# EAGLE design electron-power-bq24298 (EAGLE 7.2.0)
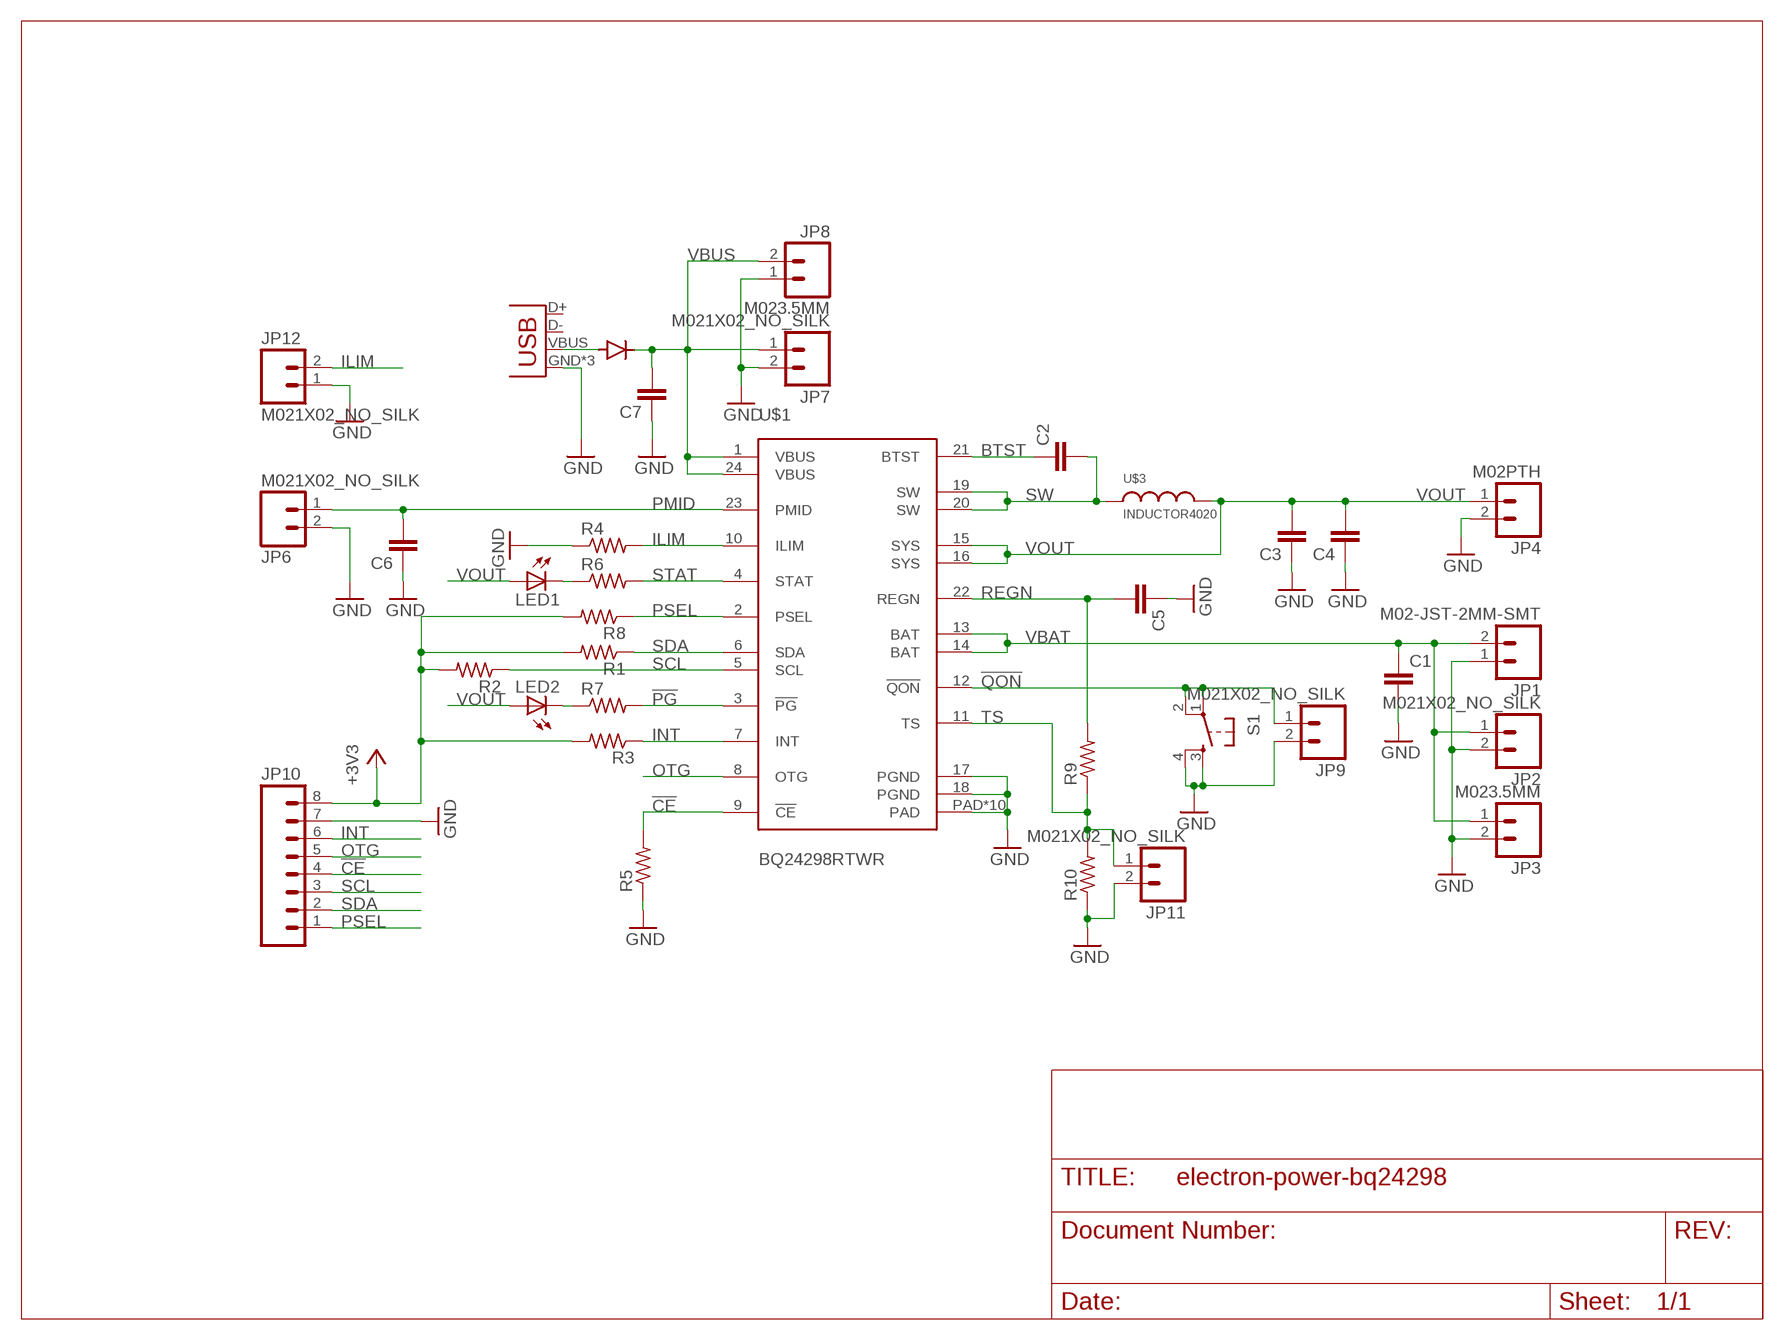
[diagram p0: schematic, sheet 1]

## Parts
C1  C-EUC0805  [C0805]
C2  C-EUC0402  [C0402]
C3  C-EUC0805  [C0805]
C4  C-EUC0805  [C0805]
C5  C-EUC0402  [C0402]
C6  C-EUC0805  [C0805]
C7  C-EUC0805  [C0805]
JP1  M02-JST-2MM-SMT  [JST-2-SMD]
JP2  M021X02_NO_SILK  [1X02_NO_SILK]
JP3  M023.5MM  [SCREWTERMINAL-3.5MM-2]
JP4  M02PTH  [1X02]
JP5  USBUSB-MICROB-SLOT-HOLE  [USB-MICROB-SLOT-HOLE]
JP6  M021X02_NO_SILK  [1X02_NO_SILK]
JP7  M021X02_NO_SILK  [1X02_NO_SILK]
JP8  M023.5MM  [SCREWTERMINAL-3.5MM-2]
JP9  M021X02_NO_SILK  [1X02_NO_SILK]
JP10  M08NO_SILK  [1X08_NO_SILK]
JP11  M021X02_NO_SILK  [1X02_NO_SILK]
JP12  M021X02_NO_SILK  [1X02_NO_SILK]
LED1  LEDSML0805  [SML0805]
LED2  LEDSML0805  [SML0805]
R1  R-US_R0402  [R0402]
R2  R-US_R0402  [R0402]
R3  R-US_R0402  [R0402]
R4  R-US_R0402  [R0402]
R5  R-US_R0402  [R0402]
R6  R-US_R0402  [R0402]
R7  R-US_R0402  [R0402]
R8  R-US_R0402  [R0402]
R9  R-US_R0402  [R0402]
R10  R-US_R0402  [R0402]
S1  TAC_SWITCHSMD  [TACTILE_SWITCH_SMD]
U$1  BQ24298RTWR  [QFN24]
U$2  DIODE  [DIODE-DO-220AA(SMP)]
U$3  INDUCTOR4020  [4020TYPE]

## Nets
!CE: JP10.4 R5.2 U$1.9(!CE)
!PG: R7.2 U$1.3(!PG)
!QON: JP9.1 S1.1 S1.2 U$1.12(!QON)
+3V3: JP10.8 R1.2 R2.2 R3.2 R8.2
BTST: C2.1 U$1.21(BTST)
GND: C1.2 C3.1 C4.1 C5.1 C6.1 C7.1 JP1.1 JP2.2 JP3.2 JP4.2 JP5.GND JP5.MT1(GND) JP5.MT2(GND) JP6.2 JP7.2 JP8.1 JP9.2 JP10.7 JP11.2 JP12.1 R4.1 R5.1 R10.1 S1.3 S1.4 U$1.17(PGND) U$1.18(PGND) U$1.PAD U$1.PAD@1(PAD) U$1.PAD@2(PAD) U$1.PAD@3(PAD) U$1.PAD@4(PAD) U$1.PAD@5(PAD) U$1.PAD@6(PAD) U$1.PAD@7(PAD) U$1.PAD@8(PAD) U$1.PAD@9(PAD)
ILIM: JP12.2 R4.2 U$1.10(ILIM)
INT: JP10.6 R3.1 U$1.7(INT)
N$2: JP5.VBUS U$2.ANODE
N$6: LED1.C R6.1
N$9: LED2.C R7.1
OTG: JP10.5 U$1.8(OTG)
PMID: C6.2 JP6.1 U$1.23(PMID)
PSEL: JP10.1 R8.1 U$1.2(PSEL)
REGN: C5.2 R9.2 U$1.22(REGN)
SCL: JP10.3 R2.1 U$1.5(SCL)
SDA: JP10.2 R1.1 U$1.6(SDA)
STAT: R6.2 U$1.4(STAT)
SW: C2.2 U$1.19(SW) U$1.20(SW) U$3.P$1
TS: JP11.1 R9.1 R10.2 U$1.11(TS)
VBAT: C1.1 JP1.2 JP2.1 JP3.1 U$1.13(BAT) U$1.14(BAT)
VBUS: C7.2 JP7.1 JP8.2 U$1.1(VBUS) U$1.24(VBUS) U$2.CATHODE
VOUT: C3.2 C4.2 JP4.1 LED1.A LED2.A U$1.15(SYS) U$1.16(SYS) U$3.P$2
Unconnected: JP5.D+ JP5.D-

## Library data of the parts
C1-C7 = rcl:C-EU: CAPACITOR, European symbol
JP1 = SparkFun-Connectors:M02: Standard 2-pin 0.1" header. Use with - straight break away headers ( PRT-00116) - right angle break away headers (PRT-00553) - swiss pins (PRT-00743) - machine pins (PRT-00117) - female headers (PRT-00115) Molex polarized connector foot print use with: PRT-08233 with associated crimp pins and housings. 2.54_SCREWTERM for use with PRT-10571. 3.5mm Screw Terminal footprints for PRT-08084 5mm Screw Terminal footprints for use with PRT-08433; PROD_ID: CONN-08352
JP2-JP4 JP6-JP9 JP11 JP12 = SparkFun-Connectors:M02: Standard 2-pin 0.1" header. Use with - straight break away headers ( PRT-00116) - right angle break away headers (PRT-00553) - swiss pins (PRT-00743) - machine pins (PRT-00117) - female headers (PRT-00115) Molex polarized connector foot print use with: PRT-08233 with associated crimp pins and housings. 2.54_SCREWTERM for use with PRT-10571. 3.5mm Screw Terminal footprints for PRT-08084 5mm Screw Terminal footprints for use with PRT-08433
JP5 = Spark:USB
JP10 = SparkFun-Connectors:M08: Header 8 Standard 8-pin 0.1" header. Use with straight break away headers (SKU : PRT-00116), right angle break away headers (PRT-00553), swiss pins (PRT-00743), machine pins (PRT-00117), and female headers (PRT-00115).
LED1 LED2 = led:LED: LED OSRAM: - CHIPLED LG R971, LG N971, LY N971, LG Q971, LY Q971, LO R971, LY R971 LH N974, LH R974 LS Q976, LO Q976, LY Q976 LO Q996 - Hyper CHIPLED LW Q18S LB Q993, LB Q99A, LB R99A - SideLED LS A670, LO A670, LY A670, LG A670, LP A670 LB A673, LV A673, LT A673, LW A673 LH A674 LY A675 LS A676, LA A676, LO A676, LY A676, LW A676 LS A679, LY A679, LG A679 - Hyper Micro SIDELED® LS Y876, LA Y876, LO Y876, LY Y876 LT Y87S - SmartLED LW L88C, LW L88S LB L89C, LB L89S, LG L890 LS L89K, LO L89K, LY L89K LS L896, LA L896, LO L896, LY L896 - TOPLED LS T670, LO T670, LY T670, LG T670, LP T670 LSG T670, LSP T670, LSY T670, LOP T670, LYG T670 LG T671, LOG T671, LSG T671 LB T673, LV T673, LT T673, LW T673 LH T674 LS T676, LA T676, LO T676, LY T676, LB T676, LH T676, LSB T676, LW T676 LB T67C, LV T67C, LT T67C, LS T67K, LO T67K, LY T67K, LW E67C LS E67B, LA E67B, LO E67B, LY E67B, LB E67C, LV E67C, LT E67C LW T67C LS T679, LY T679, LG T679 LS T770, LO T770, LY T770, LG T770, LP T770 LB T773, LV T773, LT T773, LW T773 LH T774 LS E675, LA E675, LY E675, LS T675 LS T776, LA T776, LO T776, LY T776, LB T776 LHGB T686 LT T68C, LB T68C - Hyper Mini TOPLED® LB M676 - Mini TOPLED Santana® LG M470 LS M47K, LO M47K, LY M47K Source: http://www.osram.convergy.de LUXEON: - LUMILED® LXK2-PW12-R00, LXK2-PW12-S00, LXK2-PW14-U00, LXK2-PW14-V00 LXK2-PM12-R00, LXK2-PM12-S00, LXK2-PM14-U00 LXK2-PE12-Q00, LXK2-PE12-R00, LXK2-PE12-S00, LXK2-PE14-T00, LXK2-PE14-U00 LXK2-PB12-K00, LXK2-PB12-L00, LXK2-PB12-M00, LXK2-PB14-N00, LXK2-PB14-P00, LXK2-PB14-Q00 LXK2-PR12-L00, LXK2-PR12-M00, LXK2-PR14-Q00, LXK2-PR14-R00 LXK2-PD12-Q00, LXK2-PD12-R00, LXK2-PD12-S00 LXK2-PH12-R00, LXK2-PH12-S00 LXK2-PL12-P00, LXK2-PL12-Q00, LXK2-PL12-R00 Source: www.luxeon.com KINGBRIGHT: KA-3528ASYC Source: www.kingbright.com
R1-R10 = rcl:R-US_: RESISTOR, American symbol
S1 = Spark:TAC_SWITCH: SMD Tactiile Switch
U$1 = electron:BQ24298RTWR: Bq24298 I2C Controlled 3A Single Cell USB Charger with Narrow VDC Power Path Management and Adjustable Voltage USB OTG
U$2 = Spark:DIODE
U$3 = electron:INDUCTOR: Compatible with 4012 and 4020 package style from TDK

## Board
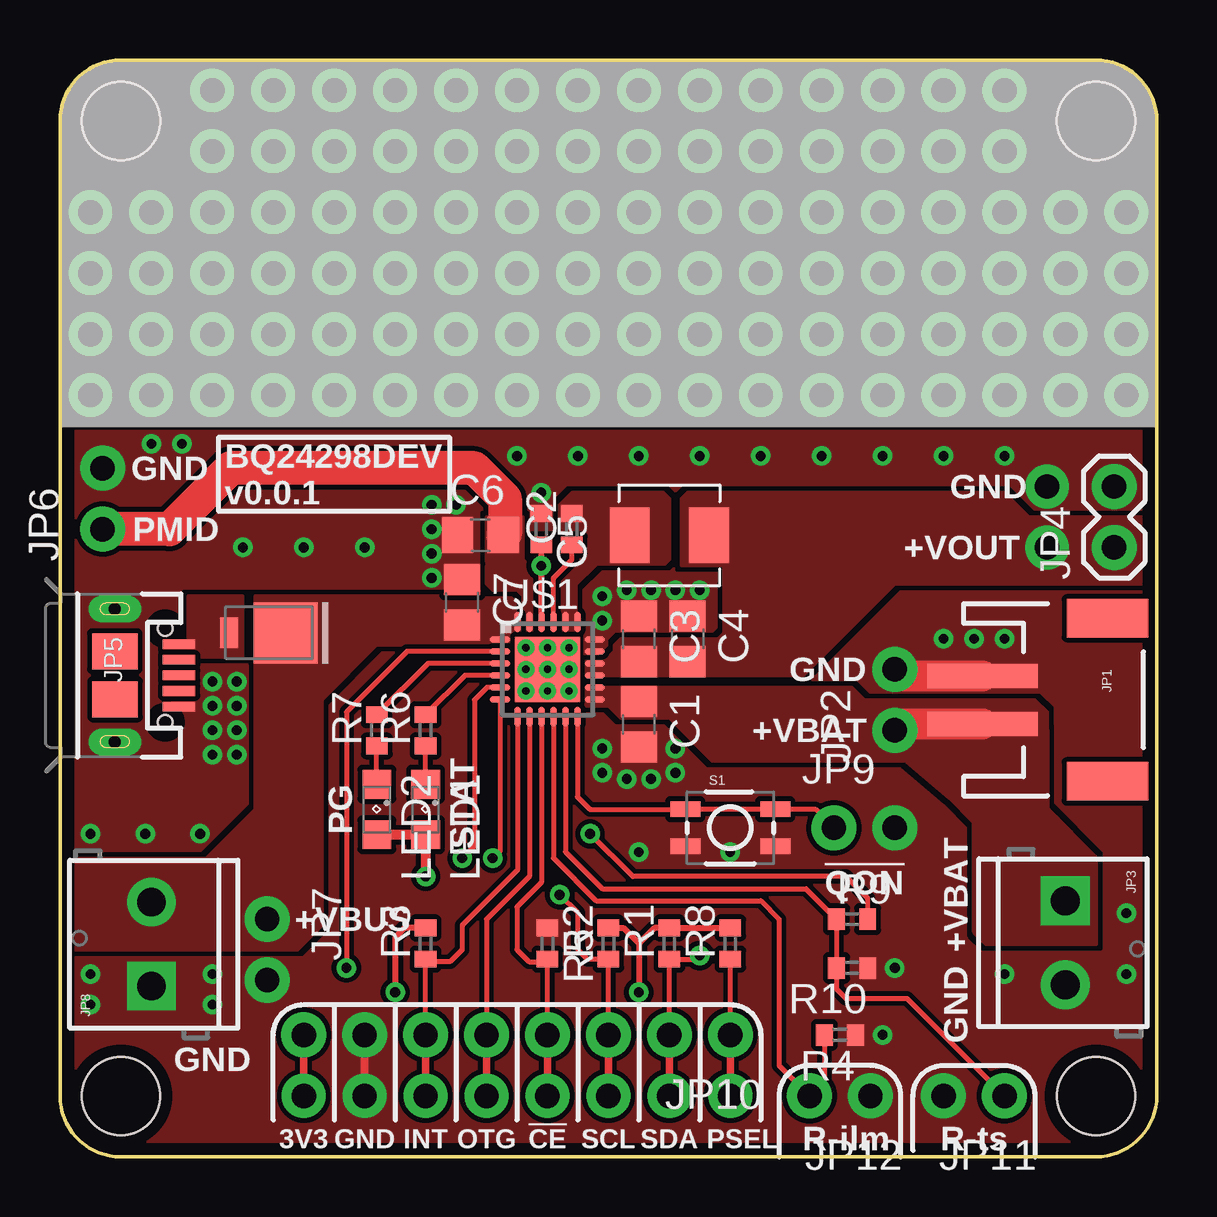
[diagram p1: board, top side]
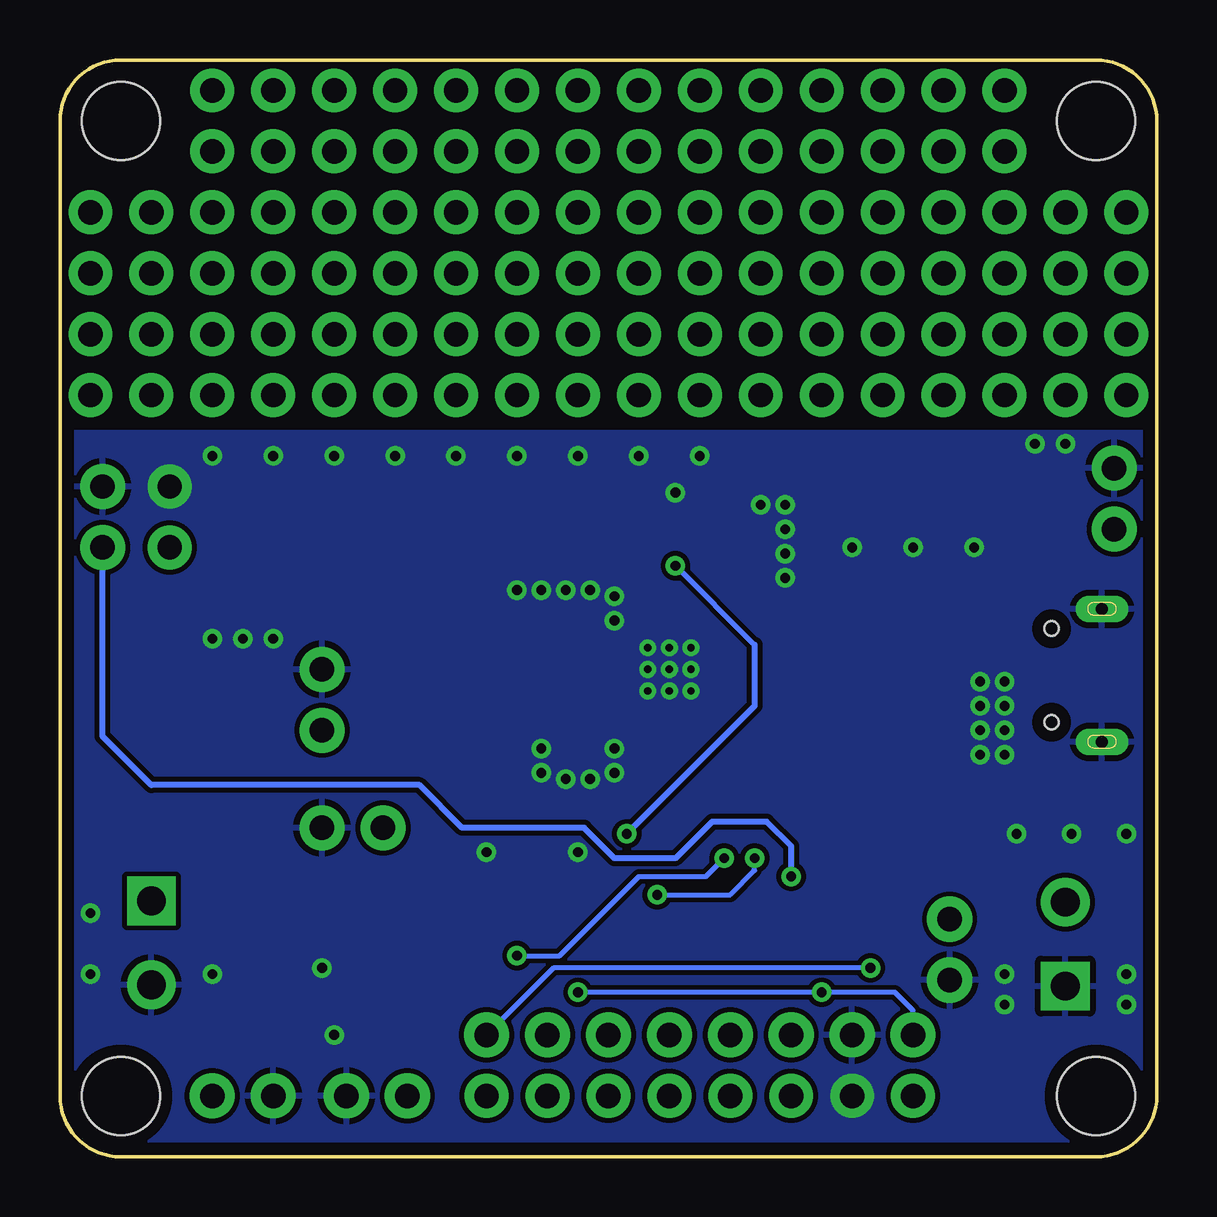
[diagram p2: board, bottom side, seen from below]

Size 45.72 x 45.72 mm. Coordinates in mm from the lower left corner, seen from the top.
Outline: 2.54,0 43.18,0 arc90 45.72,2.54 45.72,43.18 arc90 43.18,45.72 2.54,45.72 arc90 0,43.18 0,2.54 arc90 2.54,0
Copper layers (1*16): Top 0.035mm / dielectric 1.5mm / Bottom 0.035mm
Design rules "default *": minimum track width 8mil, minimum drill 12mil, track to track 8mil, track to pad 8mil, pad to pad 8mil, via to via 8mil, smd to smd 4mil, copper to edge 20mil, drill to drill 8mil, minimum pad ring 8mil, minimum via ring 8mil, stop-mask expansion 4mil, vias tented up to drill 25mil, thermal gap 10mil
Holes 3.25 mm at 2.54,2.54 43.18,2.54 2.54,43.18 43.18,43.18
tRestrict: 4 lines

### Footprints (pad centres in the part's own frame; a part is rotated, then mirrored left to right if it is on the bottom)
C0805 = smd 1.3 x 1.5: 1 -0.95,0; 2 0.95,0
C0402 = smd 0.7 x 0.9: 1 -0.65,0; 2 0.65,0
JST-2-SMD = smd 1 x 4.6: 1 -1,-3.7; 2 1,-3.7 | smd 1.6 x 3.4: NC1 -3.4,1.5; NC2 3.4,1.5
1X02_NO_SILK = drill 1.016 pad 1.88: 1 0,0; 2 2.54,0
SCREWTERMINAL-3.5MM-2 = drill 1.2 pad 2.032 square: 1 0,0 | drill 1.2 pad 2.032: 2 3.5,0
1X02 = drill 1.016 pad 1.88: 1 0,0; 2 2.54,0
USB-MICROB-SLOT-HOLE = smd 0.4 x 1.35: D+ 0,2.675; D- -0.65,2.675; GND 1.3,2.675; ID 0.65,2.675; VBUS -1.3,2.675 | drill 0.5 pad 1.1 long: MT1 -2.775,0; MT2 2.775,0 | smd 1.5 x 1.9: P$1 -1,0; P$2 1,0.01 | hole 0.6: -1.95,2.1; 1.95,2.1
1X08_NO_SILK = drill 1.016 pad 1.88: 1 0,0; 2 2.54,0; 3 5.08,0; 4 7.62,0; 5 10.16,0; 6 12.7,0; 7 15.24,0; 8 17.78,0
SML0805 = smd 1.2 x 1.2: A 1.05,0; C -1.05,0
R0402 = smd 0.7 x 0.9: 1 -0.65,0; 2 0.65,0
TACTILE_SWITCH_SMD = smd 1.25 x 0.65: 1 -1.875,0.775; 2 1.875,0.775; 3 -1.875,-0.775; 4 1.875,-0.775
QFN24 = smd 0.85 x 0.28: 1 -1.975,1.25; 2 -1.975,0.75; 3 -1.975,0.25; 4 -1.975,-0.25; 5 -1.975,-0.75; 6 -1.975,-1.25; 13 1.975,-1.25; 14 1.975,-0.75; 15 1.975,-0.25; 16 1.975,0.25; 17 1.975,0.75; 18 1.975,1.25 | smd 0.28 x 0.85: 7 -1.25,-1.975; 8 -0.75,-1.975; 9 -0.25,-1.975; 10 0.25,-1.975; 11 0.75,-1.975; 12 1.25,-1.975; 19 1.25,1.975; 20 0.75,1.975; 21 0.25,1.975; 22 -0.25,1.975; 23 -0.75,1.975; 24 -1.25,1.975 | smd 2.7 x 2.7: PAD 0,0 | drill 0.3 pad 0.406: PAD@1 -0.9,0.9; PAD@2 0,0.9; PAD@3 0.9,0.9; PAD@4 -0.9,0; PAD@5 0,0; PAD@6 0.9,0; PAD@7 -0.9,-0.9; PAD@8 0,-0.9; PAD@9 0.9,-0.9
DIODE-DO-220AA(SMP) = smd 0.762 x 1.27: ANODE 2.349,0 | smd 2.667 x 2.54: CATHODE 0,0
4020TYPE = smd 1.65 x 2.3: P$1 -1.65,0; P$2 1.65,0

### Placement (x,y rotation side)
C1  24.13,18.03 270 top
C2  21.34,26.16 90 top
C3  24.13,21.59 270 top
C4  26.16,21.59 270 top
C5  20.07,26.16 270 top
C6  17.53,25.91 0 top
C7  16.76,23.11 270 top
JP1  42.16,19.05 270 top
JP2  34.8,17.78 90 top
JP3  41.91,10.67 270 top
JP4  43.94,25.4 90 top
JP5  2.29,20.07 270 top
JP6  1.78,26.16 90 top
JP7  8.64,9.91 270 top
JP8  3.81,7.11 90 top
JP9  32.26,13.72 0 top
JP10  27.94,5.08 180 top
JP11  39.37,2.54 180 top
JP12  33.78,2.54 180 top
LED1  15.24,14.48 270 top
LED2  13.21,14.48 270 top
R1  25.4,8.89 90 top
R2  22.86,8.89 90 top
R3  15.24,8.89 90 top
R4  32.51,5.08 180 top
R5  20.32,8.89 270 top
R6  15.24,17.78 90 top
R7  13.21,17.78 90 top
R8  27.94,8.89 90 top
R9  33.02,9.91 0 top
R10  33.02,7.87 180 top
S1  27.94,13.72 0 top
U$1  20.32,20.32 0 top
U$2  9.4,21.84 180 top
U$3  25.4,25.91 0 top

### Tracks (layer width: path | path; a pad name or v marks a point on that pad's centre or on a via)
!CE  (via drill 1.02 pad 1.83)
  Top 0.203: U$1.9 20.07,11.43 19.05,10.41 19.05,8.64 19.56,8.13 20.21,8.13 R5.2 JP10.4
  Top 0.305: v20.32,2.54 JP10.4
!PG
  Top 0.203: U$1.3 15.35,20.57 R7.2
!QON
  Top 0.203: JP9.1 31.48,14.49 S1.2 S1.1 26.05,14.48 22.1,14.48 21.57,15.01 U$1.12
+3V3  (via drill 0.41, 1.02 pad 1.83)
  Top 0.254: R3.2 14.37,9.54 13.97,9.14 v13.97,6.86 | R2.2 23.48,9.54 24.13,8.89 | 24.13,8.89 v24.13,6.86 | R8.2 R1.2 24.78,9.54 24.13,8.89
  Top 0.305: v10.16,2.54 JP10.8
  Bottom 0.203: v24.13,6.86 v13.97,6.86 10.92,6.86 10.16,6.1 JP10.8
BTST
  Top 0.203: U$1.21 20.57,24.13 21.34,24.89 C2.1
GND  (via drill 0.41, 1.02 pad 1.83)
  Top 0.305: v12.7,2.54 JP10.7
  Top 1.27: JP1.1 35.07,20.05 JP2.2
  other vias: 23.62,23.62 24.64,23.62 25.65,23.62 26.67,23.62 22.61,22.35 22.61,23.37 20.07,27.69 15.49,24.13 15.49,25.15 15.49,26.16 15.49,27.18 16.51,27.18 22.61,17.02 22.61,16 23.62,15.75 24.64,15.75 25.65,16 25.65,17.02 3.81,29.72 5.08,29.72 19.05,29.21 27.94,12.7 21.59,29.21 24.13,29.21 26.67,29.21 29.21,29.21 31.75,29.21 34.29,29.21 36.83,29.21 39.37,29.21 36.83,21.59 39.37,21.59 38.1,21.59 1.27,7.62 1.27,6.35 6.35,7.62 6.35,6.35 1.27,13.46 3.56,13.46 5.84,13.46 7.37,16.76 7.62,25.4 10.16,25.4 12.7,25.4 24.13,12.7 39.37,7.62 44.45,7.62 44.45,10.16 34.8,7.87 34.29,5.08 41.15,27.94 6.35,18.8 6.35,19.81 7.37,19.81 7.37,18.8 6.35,17.78 7.37,17.78 6.35,16.76
  pour Bottom: 0,0 0,30.23 45.72,30.23 45.72,0
  pour Top (rank 4, no thermals): 0,0 0,30.23 45.72,30.23 45.72,0
  pour Top (rank 2, no thermals): 21.84,20.83 23.11,20.83 23.11,21.84 27.18,21.84 27.18,24.38 22.61,24.38 21.84,23.62
ILIM
  Top 0.203: U$1.10 20.57,12.45 22.35,10.67 29.21,10.67 29.97,9.91 29.97,3.81 JP12.2 31.86,3.16 R4.2
INT  (via drill 1.02 pad 1.83)
  Top 0.203: U$1.7 19.07,11.96 16.76,9.65 16.76,8.64 16.26,8.13 15.35,8.13 R3.1 JP10.6
  Top 0.305: v15.24,2.54 JP10.6
N$1  (via drill 1.02 pad 1.83)
  other vias: 1.27,31.75
N$2
  pour Top (no thermals): 5.33,20.83 7.62,20.83 7.62,23.37 5.33,23.37
N$3  (via drill 1.02 pad 1.83)
  other vias: 3.81,31.75
N$4  (via drill 1.02 pad 1.83)
  other vias: 6.35,31.75
N$5  (via drill 1.02 pad 1.83)
  other vias: 8.89,31.75
N$6
  Top 0.203: LED1.C R6.1
N$7  (via drill 1.02 pad 1.83)
  other vias: 11.43,31.75
N$8  (via drill 1.02 pad 1.83)
  other vias: 13.97,31.75
N$9
  Top 0.203: LED2.C R7.1
N$10  (via drill 1.02 pad 1.83)
  other vias: 16.51,31.75
N$11  (via drill 1.02 pad 1.83)
  other vias: 19.05,31.75
N$12  (via drill 1.02 pad 1.83)
  other vias: 21.59,31.75
N$13  (via drill 1.02 pad 1.83)
  other vias: 24.13,31.75
N$14  (via drill 1.02 pad 1.83)
  other vias: 26.67,31.75
N$15  (via drill 1.02 pad 1.83)
  other vias: 29.21,31.75
N$16  (via drill 1.02 pad 1.83)
  other vias: 31.75,31.75
N$17  (via drill 1.02 pad 1.83)
  other vias: 34.29,31.75
N$18  (via drill 1.02 pad 1.83)
  other vias: 36.83,31.75
N$19  (via drill 1.02 pad 1.83)
  other vias: 39.37,31.75
N$20  (via drill 1.02 pad 1.83)
  other vias: 41.91,31.75
N$21  (via drill 1.02 pad 1.83)
  other vias: 41.91,34.29
N$22  (via drill 1.02 pad 1.83)
  other vias: 39.37,34.29
N$23  (via drill 1.02 pad 1.83)
  other vias: 36.83,34.29
N$24  (via drill 1.02 pad 1.83)
  other vias: 34.29,34.29
N$25  (via drill 1.02 pad 1.83)
  other vias: 31.75,34.29
N$26  (via drill 1.02 pad 1.83)
  other vias: 29.21,34.29
N$27  (via drill 1.02 pad 1.83)
  other vias: 26.67,34.29
N$28  (via drill 1.02 pad 1.83)
  other vias: 24.13,34.29
N$29  (via drill 1.02 pad 1.83)
  other vias: 21.59,34.29
N$30  (via drill 1.02 pad 1.83)
  other vias: 19.05,34.29
N$31  (via drill 1.02 pad 1.83)
  other vias: 16.51,34.29
N$32  (via drill 1.02 pad 1.83)
  other vias: 13.97,34.29
N$33  (via drill 1.02 pad 1.83)
  other vias: 11.43,34.29
N$34  (via drill 1.02 pad 1.83)
  other vias: 8.89,34.29
N$35  (via drill 1.02 pad 1.83)
  other vias: 6.35,34.29
N$36  (via drill 1.02 pad 1.83)
  other vias: 3.81,34.29
N$37  (via drill 1.02 pad 1.83)
  other vias: 1.27,34.29
N$38  (via drill 1.02 pad 1.83)
  other vias: 1.27,36.83
N$39  (via drill 1.02 pad 1.83)
  other vias: 3.81,36.83
N$40  (via drill 1.02 pad 1.83)
  other vias: 6.35,36.83
N$41  (via drill 1.02 pad 1.83)
  other vias: 8.89,36.83
N$42  (via drill 1.02 pad 1.83)
  other vias: 11.43,36.83
N$43  (via drill 1.02 pad 1.83)
  other vias: 13.97,36.83
N$44  (via drill 1.02 pad 1.83)
  other vias: 16.51,36.83
N$45  (via drill 1.02 pad 1.83)
  other vias: 19.05,36.83
N$46  (via drill 1.02 pad 1.83)
  other vias: 21.59,36.83
N$47  (via drill 1.02 pad 1.83)
  other vias: 24.13,36.83
N$48  (via drill 1.02 pad 1.83)
  other vias: 26.67,36.83
N$49  (via drill 1.02 pad 1.83)
  other vias: 29.21,36.83
N$50  (via drill 1.02 pad 1.83)
  other vias: 31.75,36.83
N$51  (via drill 1.02 pad 1.83)
  other vias: 34.29,36.83
N$52  (via drill 1.02 pad 1.83)
  other vias: 36.83,36.83
N$53  (via drill 1.02 pad 1.83)
  other vias: 39.37,36.83
N$54  (via drill 1.02 pad 1.83)
  other vias: 41.91,36.83
N$55  (via drill 1.02 pad 1.83)
  other vias: 41.91,39.37
N$56  (via drill 1.02 pad 1.83)
  other vias: 39.37,39.37
N$57  (via drill 1.02 pad 1.83)
  other vias: 36.83,39.37
N$58  (via drill 1.02 pad 1.83)
  other vias: 31.75,39.37
N$59  (via drill 1.02 pad 1.83)
  other vias: 34.29,39.37
N$60  (via drill 1.02 pad 1.83)
  other vias: 29.21,39.37
N$61  (via drill 1.02 pad 1.83)
  other vias: 26.67,39.37
N$62  (via drill 1.02 pad 1.83)
  other vias: 24.13,39.37
N$63  (via drill 1.02 pad 1.83)
  other vias: 21.59,39.37
N$64  (via drill 1.02 pad 1.83)
  other vias: 19.05,39.37
N$65  (via drill 1.02 pad 1.83)
  other vias: 16.51,39.37
N$66  (via drill 1.02 pad 1.83)
  other vias: 13.97,39.37
N$67  (via drill 1.02 pad 1.83)
  other vias: 11.43,39.37
N$68  (via drill 1.02 pad 1.83)
  other vias: 8.89,39.37
N$69  (via drill 1.02 pad 1.83)
  other vias: 6.35,39.37
N$70  (via drill 1.02 pad 1.83)
  other vias: 3.81,39.37
N$71  (via drill 1.02 pad 1.83)
  other vias: 1.27,39.37
N$74  (via drill 1.02 pad 1.83)
  other vias: 6.35,41.91
N$75  (via drill 1.02 pad 1.83)
  other vias: 8.89,41.91
N$76  (via drill 1.02 pad 1.83)
  other vias: 11.43,41.91
N$77  (via drill 1.02 pad 1.83)
  other vias: 13.97,41.91
N$78  (via drill 1.02 pad 1.83)
  other vias: 16.51,41.91
N$79  (via drill 1.02 pad 1.83)
  other vias: 19.05,41.91
N$80  (via drill 1.02 pad 1.83)
  other vias: 21.59,41.91
N$81  (via drill 1.02 pad 1.83)
  other vias: 24.13,41.91
N$82  (via drill 1.02 pad 1.83)
  other vias: 26.67,41.91
N$83  (via drill 1.02 pad 1.83)
  other vias: 29.21,41.91
N$84  (via drill 1.02 pad 1.83)
  other vias: 31.75,41.91
N$85  (via drill 1.02 pad 1.83)
  other vias: 34.29,41.91
N$86  (via drill 1.02 pad 1.83)
  other vias: 36.83,41.91
N$87  (via drill 1.02 pad 1.83)
  other vias: 39.37,41.91
N$97  (via drill 1.02 pad 1.83)
  other vias: 6.35,44.45
N$98  (via drill 1.02 pad 1.83)
  other vias: 8.89,44.45
N$99  (via drill 1.02 pad 1.83)
  other vias: 11.43,44.45
N$100  (via drill 1.02 pad 1.83)
  other vias: 13.97,44.45
N$101  (via drill 1.02 pad 1.83)
  other vias: 16.51,44.45
N$102  (via drill 1.02 pad 1.83)
  other vias: 19.05,44.45
N$103  (via drill 1.02 pad 1.83)
  other vias: 21.59,44.45
N$104  (via drill 1.02 pad 1.83)
  other vias: 24.13,44.45
N$105  (via drill 1.02 pad 1.83)
  other vias: 26.67,44.45
N$106  (via drill 1.02 pad 1.83)
  other vias: 29.21,44.45
N$107  (via drill 1.02 pad 1.83)
  other vias: 31.75,44.45
N$108  (via drill 1.02 pad 1.83)
  other vias: 34.29,44.45
N$109  (via drill 1.02 pad 1.83)
  other vias: 36.83,44.45
N$110  (via drill 1.02 pad 1.83)
  other vias: 39.37,44.45
N$114  (via drill 1.02 pad 1.83)
  other vias: 44.45,31.75
N$115  (via drill 1.02 pad 1.83)
  other vias: 44.45,34.29
N$116  (via drill 1.02 pad 1.83)
  other vias: 44.45,36.83
N$117  (via drill 1.02 pad 1.83)
  other vias: 44.45,39.37
OTG  (via drill 1.02 pad 1.83)
  Top 0.203: U$1.8 19.57,11.7 17.78,9.91 JP10.5
  Top 0.305: v17.78,2.54 JP10.5
PMID
  Top 1.422: C6.2 18.54,25.97 18.54,27.43 17.27,28.7 7.11,28.7 4.57,26.16 JP6.1
  pour Top (no thermals): 19.81,21.84 19.81,24.38 19.3,24.89 19.3,26.67 17.78,26.67 17.78,23.88 18.03,23.62 19.05,23.62 19.3,23.37 19.3,21.84
PSEL  (via drill 0.41, 1.02 pad 1.83)
  Top 0.203: U$1.2 14.47,21.07 11.94,18.54 v11.94,7.87 | JP10.1 R8.1
  Top 0.305: v27.94,2.54 JP10.1
  Bottom 0.203: v11.94,7.87 25.15,7.87 JP10.1
REGN  (via drill 0.41)
  Top 0.203: v20.07,24.64 C5.2 | R9.2 33.67,10.78 32.77,11.68 23.88,11.68 v22.1,13.46
  Top 0.254: U$1.22 C5.2
  Bottom 0.203: 16.76,21.34 v20.07,24.64
  Bottom 0.254: 16.76,21.34 16.76,18.8 v22.1,13.46
SCL  (via drill 0.41, 1.02 pad 1.83)
  Top 0.203: JP10.3 R2.1 21.99,8.24 21.59,8.64 21.59,10.16 v20.83,10.92 | U$1.5 17.79,19.57 17.27,19.05 17.27,12.95 v16.76,12.45
  Top 0.305: v22.86,2.54 JP10.3
  Bottom 0.203: v20.83,10.92 17.78,10.92 16.76,11.94 v16.76,12.45
SDA  (via drill 0.41, 1.02 pad 1.83)
  Top 0.203: JP10.2 R1.1 26.53,8.24 v26.67,8.38 | U$1.6 18.34,12.76 v18.03,12.45
  Top 0.305: v25.4,2.54 JP10.2
  Bottom 0.203: v18.03,12.45 18.8,11.68 21.59,11.68 24.89,8.38 v26.67,8.38
STAT
  Top 0.203: U$1.4 16.88,20.07 R6.2
SW
  pour Top (rank 3, no thermals): 20.83,21.84 21.84,21.84 21.84,23.11 23.11,24.38 24.89,24.38 25.4,24.89 25.4,27.43 25.15,27.69 21.34,27.69 20.83,27.18
TS
  Top 0.203: U$1.11 21.07,12.71 22.61,11.18 31.1,11.18 R9.1 R10.2 32.37,7 32.77,6.6 35.31,6.6 JP11.1
VBAT
  Top 1.27: JP2.1 35.07,18.05 JP1.2
  pour Top (rank 2, no thermals): 21.84,18.8 22.86,18.8 23.37,18.29 25.4,18.29 27.18,16.51 40.39,16.51 41.15,17.27 41.15,18.54 40.64,19.05 33.53,19.05 33.02,19.56 21.84,19.56
  pour Top (no thermals): 43.18,8.89 43.18,12.45 41.15,14.48 41.15,17.78 35.31,18.03 35.31,16.51 37.08,14.99 38.1,13.97 38.1,9.4 38.61,8.89
VBUS
  pour Top (rank 2, no thermals): 0,8.64 9.91,8.64 10.92,9.65 10.92,19.05 13.21,21.34 18.8,21.34 19.3,21.84 19.3,22.86 18.8,23.37 8.13,23.37 8.13,14.48 6.1,12.45 0,12.45
VOUT  (via drill 0.41, 1.02 pad 1.83)
  Top 0.406: LED2.A LED1.A v15.24,11.68
  Bottom 0.254: v15.24,11.68 15.24,12.95 16.26,13.97 18.54,13.97 20.07,12.45 22.61,12.45 23.88,13.72 28.96,13.72 30.73,15.49 41.91,15.49 43.94,17.53 JP4.1
  other vias: 41.15,25.4
  pour Top (no thermals): 21.84,20.07 30.99,20.07 34.8,23.88 45.47,23.88 45.47,26.67 40.39,26.67 39.37,27.69 26.16,27.69 25.91,27.43 25.91,24.64 27.69,24.64 27.69,21.84 27.43,21.59 23.37,21.59 23.11,21.34 23.11,21.08 22.86,20.83 21.84,20.83

### Text on the board
tPlace: GND | BQ24298DEV / v0.0.1 | GND | PMID | +VOUT | GND | +VBAT | STAT | PG | !QON | +VBAT | +VBUS | GND | GND | 3V3 | GND | INT | OTG | !CE | SCL | SDA | PSEL | R-ilm | R-ts